# Altium schematic sheet Motor_Hat.SchDoc: Driver Motor for Raspberry PI3
size A4; Author: Frank Facundo; DrawnBy: Frank Facundo; Organization: Télécom ParisTech; Address1: Reading Mood; Address2: PACT 3.5; DocumentNumber: 1; Revision: 1; SheetNumber: 1; SheetTotal: 1; ProjectName: Reading Mood; Application_BuildNumber: 1
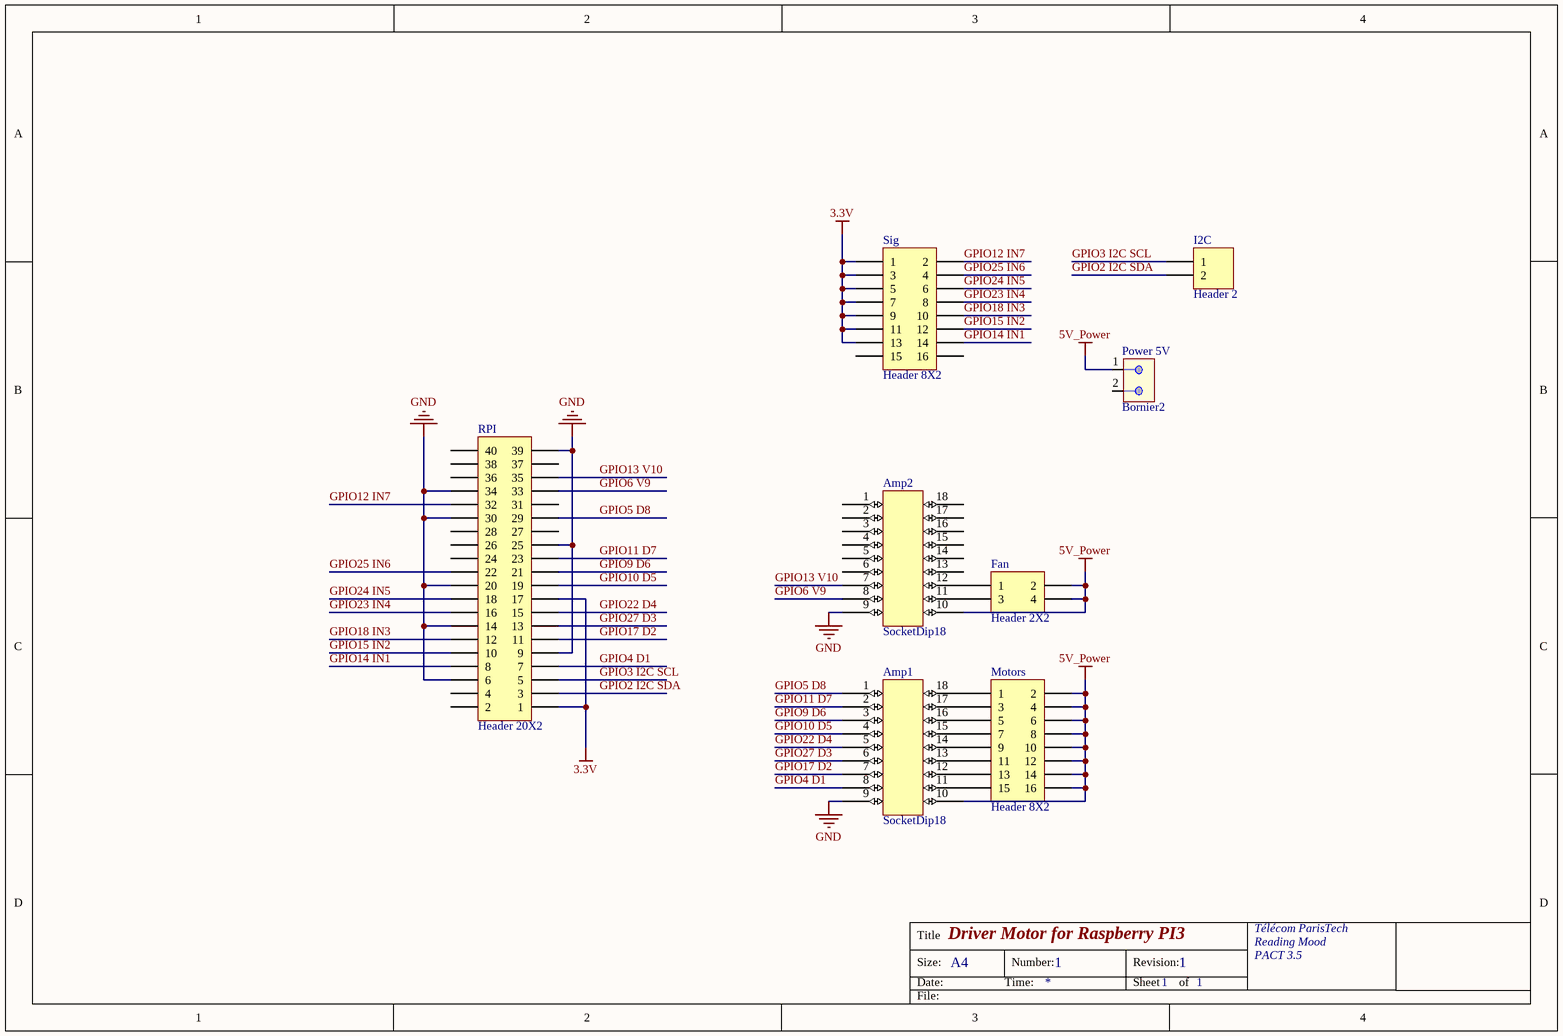
[diagram p0: Motor_Hat.SchDoc]

## Parts
Amp1  SocketDip18  [DIP18]
Amp2  SocketDip18  [DIP18]
Fan  Header 2X2  [HDR2X2]
I2C  Header 2  [HDR1X2]
Motors  Header 8X2  [HDR2X8]
Power_5V  Bornier2  [Bornier2]
RPI  Header 20X2  [HDR2X20]
Sig  Header 8X2  [HDR2X8]

## Nets
3.3V: RPI.1 RPI.17 Sig.1 Sig.3 Sig.5 Sig.7 Sig.9 Sig.11 Sig.13
5V_Power: Amp1.10 Amp2.10 Fan.2 Fan.4 Motors.2 Motors.4 Motors.6 Motors.8 Motors.10 Motors.12 Motors.14 Motors.16 Power_5V.1
GND: Amp1.9 Amp2.9 RPI.6 RPI.9 RPI.14 RPI.20 RPI.25 RPI.30 RPI.34 RPI.39
GPIO2 I2C SDA: I2C.2 RPI.3
GPIO3 I2C SCL: I2C.1 RPI.5
GPIO4 D1: Amp1.8 RPI.7
GPIO5 D8: Amp1.1 RPI.29
GPIO6 V9: Amp2.8 RPI.33
GPIO9 D6: Amp1.3 RPI.21
GPIO10 D5: Amp1.4 RPI.19
GPIO11 D7: Amp1.2 RPI.23
GPIO12 IN7: RPI.32 Sig.2
GPIO13 V10: Amp2.7 RPI.35
GPIO14 IN1: RPI.8 Sig.14
GPIO15 IN2: RPI.10 Sig.12
GPIO17 D2: Amp1.7 RPI.11
GPIO18 IN3: RPI.12 Sig.10
GPIO22 D4: Amp1.5 RPI.15
GPIO23 IN4: RPI.16 Sig.8
GPIO24 IN5: RPI.18 Sig.6
GPIO25 IN6: RPI.22 Sig.4
GPIO27 D3: Amp1.6 RPI.13
NetAmp1_11: Amp1.11 Motors.15
NetAmp1_12: Amp1.12 Motors.13
NetAmp1_13: Amp1.13 Motors.11
NetAmp1_14: Amp1.14 Motors.9
NetAmp1_15: Amp1.15 Motors.7
NetAmp1_16: Amp1.16 Motors.5
NetAmp1_17: Amp1.17 Motors.3
NetAmp1_18: Amp1.18 Motors.1
NetAmp2_11: Amp2.11 Fan.3
NetAmp2_12: Amp2.12 Fan.1

Not connected (* = marked no-connect by the designer): Amp2 1 2 3 4 5 6 13 14 15 16 17 18; Power_5V 2; RPI 2 4 24 26 27 28 31 36 37 38 40; Sig 15 16

## Notes on the sheet
- Title
- Size:
- Date:
- A4
- Time:
- Number:
- Revision:
- Sheet
- of
- File:

## Library data of the parts
Fan = Header 2X2: Header, 2-Pin, Dual row; LatestRevisionDate: 17-Jul-2002; LatestRevisionNote: Re-released for DXP Platform.; Publisher: Altium Limited
I2C = Header 2: Header, 2-Pin; LatestRevisionDate: 17-Jul-2002; LatestRevisionNote: Re-released for DXP Platform.; Publisher: Altium Limited
Motors Sig = Header 8X2: Header, 8-Pin, Dual row; LatestRevisionDate: 17-Jul-2002; LatestRevisionNote: Re-released for DXP Platform.; Publisher: Altium Limited
RPI = Header 20X2: Header, 20-Pin, Dual row; LatestRevisionDate: 17-Jul-2002; LatestRevisionNote: Re-released for DXP Platform.; Publisher: Altium Limited